# Altium project hearing_aid.PrjPcb
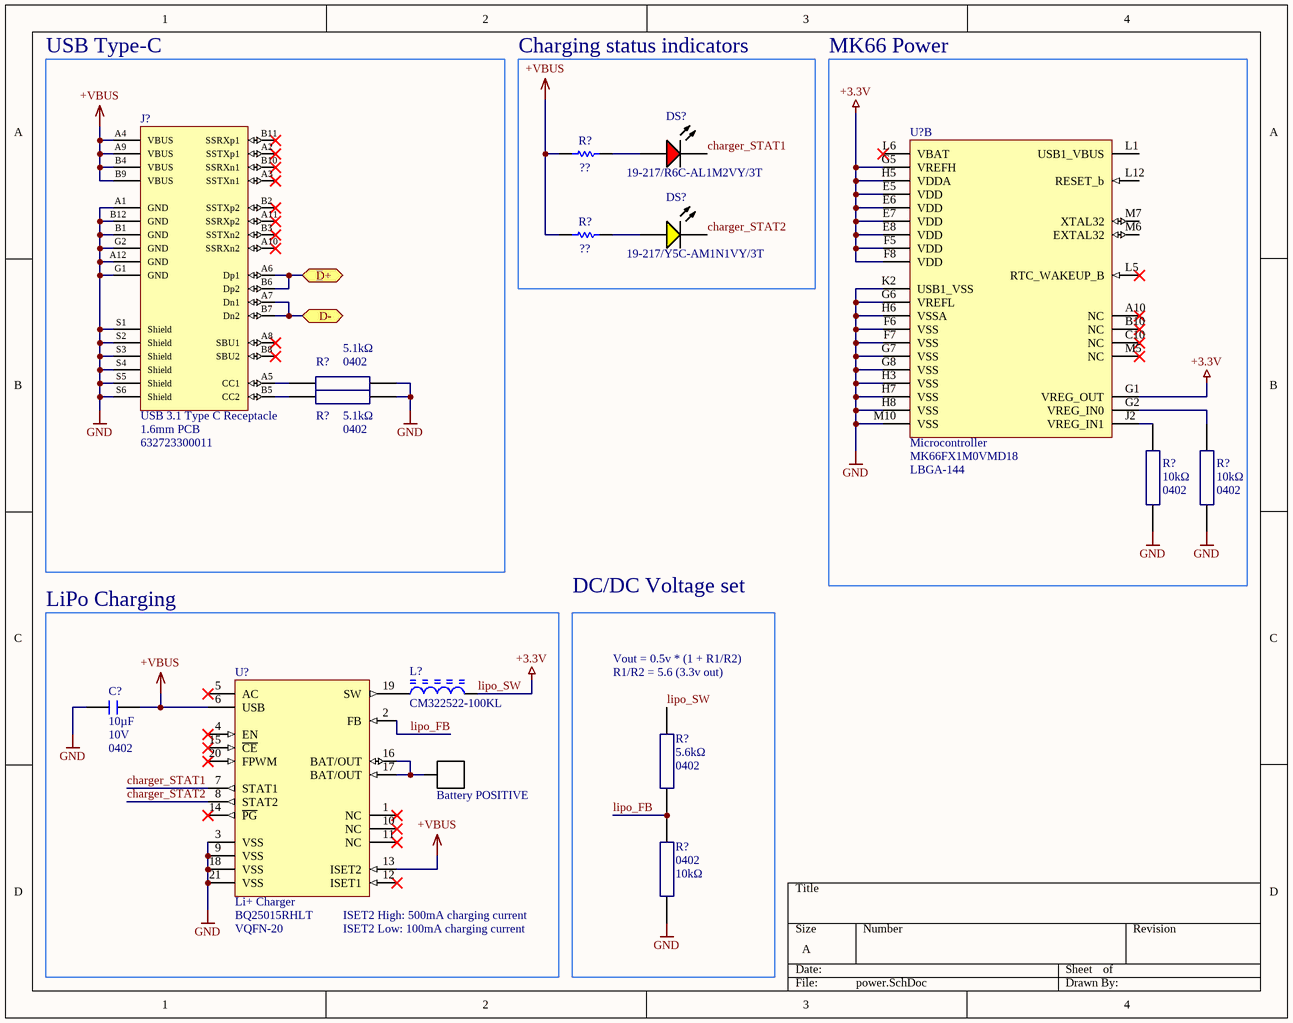
[diagram p0: power.SchDoc]
3 sheets, 45 parts. Net scope: flat (ports and power ports of the same name join across sheets).
Sheets:
  power.SchDoc
  digital.SchDoc
  audio.SchDoc

## Sheet power.SchDoc
size A

### Parts
(Parts that share a designator on the sheet are numbered #1, #2 ... from top to bottom, then left to right.)
Battery_POSITIVE  wire_pad_square  [WIRE_PAD_SQUARE]  (value not drawn)  (no BOM)
C?#1  Capacitance: 10µF  Voltage Rating: 10V  Case Code (Imperial): 0402  [0402_capacitor]  (hidden comment: CL05A106MP8NUB8)
DS?#1  19-217/R6C-AL1M2VY/3T  [EVRL-0603-2_V]
DS?#2  19-217/Y5C-AM1N1VY/3T  [EVRL-0603-2_V]
J?  USB 3.1 Type C Receptacle  PCB Thickness: 1.6mm PCB  [632723300011]
L?  CM322522-100KL  [BOUR-CM322522_V]
R?#1  value ??  [RESC1608X55X25ML10T15]  (hidden comment: Resistor 0R +/- 5% 0603 100 mW)
R?#2  value ??  [RESC1608X55X25ML10T15]  (hidden comment: Resistor 0R +/- 5% 0603 100 mW)
R?#3  Resistance: 5.1kΩ  Size Code: 0402  [0402_resistor]  (hidden comment: RMCF0402FT5K10)
R?#4  Resistance: 5.1kΩ  Size Code: 0402  [0402_resistor]  (hidden comment: RMCF0402FT5K10)
R?#5  Case Code (Imperial): 0402  Resistance: 10kΩ  [0402_resistor]  (hidden comment: RMCF0402FT10K0)
R?#6  Case Code (Imperial): 0402  Resistance: 10kΩ  [0402_resistor]  (hidden comment: RMCF0402FT10K0)
R?#7  Resistance: 5.6kΩ  Size Code: 0402  [0402_resistor]  (hidden comment: RMCF0402FT5K60_1)
R?#8  Case Code (Imperial): 0402  Resistance: 10kΩ  [0402_resistor]  (hidden comment: RMCF0402FT10K0)
U?#1  Microcontroller  Package: LBGA-144  [BGA-144]  (part B of 2)
U?#2  Li+ Charger  [VQFN-20]

### Blocks framed on the sheet
USB Type-C: J? R?#3 R?#4
Charging status indicators: DS?#1 DS?#2 R?#1 R?#2
MK66 Power: R?#5 R?#6 U?#1
LiPo Charging: Battery_POSITIVE C?#1 L? U?#2
DC/DC Voltage set: R?#7 R?#8

### Ports
D+ (bidir), D- (bidir)

### Nets
+VBUS: C?#1.2 J?.A4(VBUS) J?.A9(VBUS) J?.B4(VBUS) J?.B9(VBUS) R?#1.1 R?#2.1 U?#2.6(USB) U?#2.13(ISET2)
GND: C?#1.1 J?.A1(GND) J?.A12(GND) J?.B1(GND) J?.B12(GND) J?.G1(GND) J?.G2(GND) J?.S1(Shield) J?.S2(Shield) J?.S3(Shield) J?.S4(Shield) J?.S5(Shield) J?.S6(Shield) R?#3.2 R?#4.2 R?#5.1 R?#6.1 R?#8.1 U?#1.F6(VSS) U?#1.F7(VSS) U?#1.G6(VREFL) U?#1.G7(VSS) U?#1.G8(VSS) U?#1.H3(VSS) U?#1.H6(VSSA) U?#1.H7(VSS) U?#1.H8(VSS) U?#1.K2(USB1_VSS) U?#1.M10(VSS) U?#2.3(VSS) U?#2.9(VSS) U?#2.18(VSS) U?#2.21(VSS)
lipo_SW: L?.2 R?#7.2 U?#1.E5(VDD) U?#1.E6(VDD) U?#1.E7(VDD) U?#1.E8(VDD) U?#1.F5(VDD) U?#1.F8(VDD) U?#1.G1(VREG_OUT) U?#1.G5(VREFH) U?#1.H5(VDDA)  [also labelled +3.3V]
charger_STAT1: DS?#1.2(K) U?#2.7(STAT1)
charger_STAT2: DS?#2.2(K) U?#2.8(STAT2)
lipo_FB: R?#7.1 R?#8.2 U?#2.2(FB)
NetBattery_POSITIVE_1: Battery_POSITIVE.1 U?#2.16(BAT/OUT) U?#2.17(BAT/OUT)
NetDS?#1_1: DS?#1.1(A) R?#1.2
NetDS?#2_1: DS?#2.1(A) R?#2.2
NetJ?_A5: J?.A5(CC1) R?#3.1
NetJ?_A6: J?.A6(Dp1) J?.B6(Dp2) ; port D+
NetJ?_A7: J?.A7(Dn1) J?.B7(Dn2) ; port D-
NetJ?_B5: J?.B5(CC2) R?#4.1
NetL?_1: L?.1 U?#2.19(SW)
NetR?#5_2: R?#5.2 U?#1.J2(VREG_IN1)
NetR?#6_2: R?#6.2 U?#1.G2(VREG_IN0)

Not connected (* = marked no-connect by the designer): J? A2(SSTXp1)* A3(SSTXn1)* A8(SBU1)* A10(SSRXn2)* A11(SSRXp2)* B2(SSTXp2)* B3(SSTXn2)* B8(SBU2)* B10(SSRXn1)* B11(SSRXp1)*; U?#1 A10(NC)* B10(NC)* C10(NC)* L1(USB1_VBUS) L5(RTC_WAKEUP_B)* L6(VBAT)* L12(RESET_b) M5(NC)* M6(EXTAL32) M7(XTAL32); U?#2 1(NC)* 4(EN)* 5(AC)* 10(NC)* 11(NC)* 12(ISET1)* 14(~{PG})* 15(~{CE})* 20(FPWM)*

### Notes on the sheet
- Vout = 0.5v * (1 + R1/R2)
- R1/R2 = 5.6 (3.3v out)
- (near U?#2) ISET2 High: 500mA charging current
- (near U?#2) ISET2 Low: 100mA charging current

### Library data of the parts
Battery_POSITIVE = wire_pad_square: 1.5mm square wire pad
C?#1 = CL05A106MP8NUB8: 10 µF, 10 V, X5R, 0402 Chip capacitor; Manufacturer: Samsung; Tolerance: 20%; Supplier 1: Digi-Key; Supplier Part Number 1: 1276-6830-1-ND; RoHS: Yes; Category: Ceramic Capacitors; Stock 1: 740658; Pricing 1: 1=0.36000, 10=0.25300, 50=0.17720, 100=0.15180, 500=0.11384, 1000=0.09614, 2500=0.09108 (USD); Mount: Surface Mount; Case/Package: 0402; Case Code (Metric): 1005; Min Operating Temperature: -55°C; Max Operating Temperature: 85°C; Packaging: Tape and Reel; Length: 0.039inch; Width: 0.02inch; Thickness: 0.035inch; RoHS Compliant: Yes; ComponentLink1URL: http://www.samsungsem.com/kr/support/product-search/mlcc/CL05A106MP8NUB8.jsp?src-supplier=Digi-Key; ComponentLink1Description: http://www.samsungsem.com/kr/support/product-search/mlcc/CL05A106MP8NUB8.jsp?src-supplier=Digi-Key; Manufacturer Part Number: CL05A106MP8NUB8
DS?#1 = CMP-007-00004-2: Chip LED, Red, 5 V, 25 mA, -40 to 85 degC, 2-Pin SMD (0603), RoHS, Tape and Reel; Manufacturer: Everlight Electronics; Forward Voltage: 2.2V; Lens Style: Clear; Package Reference: 0603; Datasheet Version: Rev. 1, 01/2005; Mounting Technology: SM; RoHS Compliant: False; Datasheet URL: https://datasheet.ciiva.com/4688/el-19-217-r6c-al1m2vy-3tpdf-187026-4688713.pdf; Case/Package: 0603; Colour: Red; Manufacturer URL: http://www.everlight.com/; Package Description: 2-Pin Surface Mount Device, Body 1.6 x 0.8 mm
DS?#2 = CMP-007-00005-2: Chip LED, Yellow, 5 V, 25mA, -40 to 85 degC, 2-Pin SMD (0603), RoHS, Tape and Reel; Manufacturer: Everlight Electronics; Datasheet Version: Rev. 1.0, 12/2005; Package Reference: 0603; Mounting Technology: SM; Package Description: 2-Pin Surface Mount Device, Body 1.6 x 0.8 mm; Case/Package: 0603; Datasheet URL: http://www.fairchip.com/pdf/Everlight/19-217-Y5C-AM1N1VY-3T.pdf; Manufacturer URL: http://www.everlight.com/; RoHS Compliant: False
J? = 632723300011: USB-C jack; Manufacturer: Wurth Electronics; Number of Contacts: 24; Supplier 1: Digi-Key; Stock 1: 18753; Pricing 1: 1=4.1, 10=3.8, 50=3.2, 100=2.95 (USD); Mount: Surface Mount,Through Hole; Packaging: Tape and Reel; Connector Type: USB; Gender: Receptacle; ComponentLink1URL: https://www.mouser.com/ds/2/445/632723x00011-782157.pdf?src-supplier=Mouser; ComponentLink1Description: https://www.mouser.com/ds/2/445/632723x00011-782157.pdf?src-supplier=Mouser; ComponentLink2URL: https://katalog.we-online.de/em/datasheet/632723x00011.pdf?src-supplier=Digi-Key; ComponentLink2Description: https://katalog.we-online.de/em/datasheet/632723x00011.pdf?src-supplier=Digi-Key; Supplier Part Number 1: 732-9618-1-ND; Manufacturer Part Number: 632723300011
L? = CMP-1747-00008-1: Chip Inductor / , 10 uH, +/- 10%, -40 to 125 degC, 1210 (3225 Metric), RoHS, Tape and Reel; Current Rating: 1.5 A; Colour: White; Gender: Female; Connector Type: USB; Min Operating Temperature: -55 degC; ComponentLink2Description: Datasheet; Packaging: Tray; Contact Material: Bronze; ComponentLink1Description: Manufacturer URL; PackageDescription: 2-Pin Surface Mount Device, Body 3.2 x 2.5 mm; Contact Plating: Gold; Max Operating Temperature: 85 degC; ComponentLink2URL: http://www.bourns.com/docs/Product-Datasheets/cm322522.pdf; PackageReference: 1210; Radiation Hardening: No; DatasheetVersion: Aug-14; Package Quantity: 100; Pins: 4; Mount: Through Hole; Lead Pitch: 2.5 mm; ComponentLink1URL: http://www.bourns.com/; Height: 15.9 mm; RoHSCompliant: true; Width: 11.15 mm
R?#1 R?#2 = CMP-009-00006-5: 5.1k; Power: 100mW; Voltage Rating: 50V; Max Operating Temperature: 155°C; RoHS Compliant: True; Mounting Technology: SM; Case/Package: 0603; Min Operating Temperature: -55°C; Tolerance: 5%; Pins: 2
R?#3 R?#4 = RMCF0402FT5K10: 5.1k Ω, 0402 Chip resistor; Manufacturer: Stackpole Electronics; Manufacturer Part Number: RMCF0402FT27R0; Tolerance: 1%; Rated Power Dissipation (P): 63mW; Rated Temperature: 70°C; Temperature Coefficient: 100ppm/°C; Working Voltage: 50V; Package Height: 0.3mm; Package Length: 1mm; Package Width: 0.5mm; Reference Standard: AEC-Q200; RoHS: Yes; Category: Chip SMD Resistors; Stock 1: 3710; Pricing 1: 1=0.10000, 10=0.01500, 100=0.00610, 1000=0.00274, 2500=0.00238, 5000=0.00197 (USD); Mount: Surface Mount; Number of Pins: 2; Package Shape: Rectangular; Terminal Finish: Nickel; Min Operating Temperature: -55°C; Max Operating Temperature: 155°C; JESD-609 Code: e3; Resistor Type: FIXED RESISTOR; Construction: Rectangular; Package Style: SMTMeter; Packaging: Tape and Reel; Technology: METAL GLAZE/THICK FILM; Termination: Wraparound; REACH SVHC: Yes; RoHS Compliant: Yes
R?#5 R?#6 R?#8 = RMCF0402FT10K0: 10 kΩ, 0402 Chip resistor; Manufacturer: Stackpole Electronics; Tolerance: 1%; Power Rating: 62.5mW; Temperature Coefficient: 100ppm/°C; Max Power Dissipation: 63mW; Supplier 1: Digi-Key; Manufacturer Part Number: RMCF0402FT10K0; RoHS: Yes; Category: Chip SMD Resistors; Stock 1: 7219214; Pricing 1: 1=0.10000, 10=0.01300, 100=0.00530, 1000=0.00239, 2500=0.00207, 5000=0.00171 (USD); Mount: Surface Mount; Case/Package: 0402; Case Code (Metric): 1005; Contact Plating: Tin,Matte; Size Code: 0402; Min Operating Temperature: -55°C; Max Operating Temperature: 155°C; Packaging: Tape and Reel; Resistor Type: Thick Film; Number of Terminations: 2; Features: Automotive AEC-Q200; Series: RMCF; Construction: Rectangular; Length: 1mm; Width: 0.02inch; Height: 0.016inch; Depth: 0.5mm; Radiation Hardening: No; Military Standard: Not; Lead Free: Lead Free; RoHS Compliant: Yes; ComponentLink1URL: https://datasheet.ciiva.com/24341/sei-rmcp-24341800.pdf?src-supplier=Onlinecomponents.com; ComponentLink1Description: https://datasheet.ciiva.com/24341/sei-rmcp-24341800.pdf?src-supplier=Onlinecomponents.com; Supplier Part Number 1: RMCF0402FT10K0CT-ND
R?#7 = RMCF0402FT5K60_1: 5.6k Ω, 0402 Chip resistor; Manufacturer: Stackpole Electronics; Manufacturer Part Number: RMCF0402FT27R0; Tolerance: 1%; Rated Power Dissipation (P): 63mW; Rated Temperature: 70°C; Temperature Coefficient: 100ppm/°C; Working Voltage: 50V; Package Height: 0.3mm; Package Length: 1mm; Package Width: 0.5mm; Reference Standard: AEC-Q200; RoHS: Yes; Category: Chip SMD Resistors; Stock 1: 3710; Pricing 1: 1=0.10000, 10=0.01500, 100=0.00610, 1000=0.00274, 2500=0.00238, 5000=0.00197 (USD); Mount: Surface Mount; Number of Pins: 2; Package Shape: Rectangular; Terminal Finish: Nickel; Min Operating Temperature: -55°C; Max Operating Temperature: 155°C; JESD-609 Code: e3; Resistor Type: FIXED RESISTOR; Construction: Rectangular; Package Style: SMTMeter; Packaging: Tape and Reel; Technology: METAL GLAZE/THICK FILM; Termination: Wraparound; REACH SVHC: Yes; RoHS Compliant: Yes
U?#1 = MK66FX1M0VMD18: ARM Cortex-M4 microcontroller; Manufacturer: NXP Freescale; Supplier 1: Digi-Key; Stock 1: 0; Pricing 1: 1=23.34, 10=23.108 (USD); RoHS Compliant: Yes; ComponentLink1URL: http://www.mouser.com/ds/2/302/K66P144M180SF5V2-907544.pdf?src-supplier=Mouser; ComponentLink1Description: http://www.mouser.com/ds/2/302/K66P144M180SF5V2-907544.pdf?src-supplier=Mouser; ComponentLink2URL: https://www.nxp.com/docs/en/package-information/98ASA00222D.pdf?src-supplier=Digi-Key; ComponentLink2Description: https://www.nxp.com/docs/en/package-information/98ASA00222D.pdf?src-supplier=Digi-Key; ComponentLink3URL: http://www.farnell.com/datasheets/2292635.pdf?src-supplier=Farnell; ComponentLink3Description: http://www.farnell.com/datasheets/2292635.pdf?src-supplier=Farnell; ComponentLink4URL: http://www.farnell.com/datasheets/2292635.pdf?src-supplier=Newark; ComponentLink4Description: http://www.farnell.com/datasheets/2292635.pdf?src-supplier=Newark; Supplier Part Number 1: 568-13335-ND; Manufacturer Part Number: MK66FX1M0VMD18
U?#2 = BQ25015RHLT: Li+ Battery Chager, VQFN-20; Manufacturer: Texas Instruments; Output Voltage: 700mV; Output Current: 500mA; Number of Cells: 1; Max Supply Voltage: 6.5V; Min Supply Voltage: 4.35V; Min Input Voltage: 4.5V; Switching Frequency: 1MHz; Supplier 1: Digi-Key; Stock 1: 62; Pricing 1: 1=4.78, 10=4.289, 25=4.0544, 100=3.5139 (USD); Case/Package: VQFN; Number of Pins: 20; Weight: 0.001668oz; Contact Plating: Gold; Min Operating Temperature: -40°C; Max Operating Temperature: 125°C; Package Quantity: 1; Series: -; Packaging: Tape and Reel; Max Output Current: 500mA; Max Charge Current: 500mA; Length: 4.5mm; Width: 3.5mm; Height: 0.9mm; Radiation Hardening: No; REACH SVHC: No SVHC; Lead Free: Lead Free; RoHS Compliant: Yes; ComponentLink1URL: http://www.ti.com/lit/ds/symlink/bq25017.pdf?src-supplier=Farnell; ComponentLink1Description: http://www.ti.com/lit/ds/symlink/bq25017.pdf?src-supplier=Farnell; ComponentLink2URL: http://www.ti.com/lit/ds/symlink/bq25017.pdf?src-supplier=Element14; ComponentLink2Description: http://www.ti.com/lit/ds/symlink/bq25017.pdf?src-supplier=Element14; ComponentLink3URL: http://www.ti.com/general/docs/suppproductinfo.tsp?distId=10&amp;gotoUrl=http%3A%2F%2Fwww.ti.com%2Flit%2Fgpn%2Fbq25015&src-supplier=Digi-Key; ComponentLink3Description: http://www.ti.com/general/docs/suppproductinfo.tsp?distId=10&amp;gotoUrl=http%3A%2F%2Fwww.ti.com%2Flit%2Fgpn%2Fbq25015&src-supplier=Digi-Key; ComponentLink4URL: https://media.digikey.com/pdf/Data%20Sheets/Texas%20Instruments%20PDFs/BQ25015,17.pdf?src-supplier=Digi-Key; ComponentLink4Description: https://media.digikey.com/pdf/Data%20Sheets/Texas%20Instruments%20PDFs/BQ25015,17.pdf?src-supplier=Digi-Key; ComponentLink5URL: http://www.ti.com/lit/gpn/bq25015?src-supplier=Mouser; ComponentLink5Description: http://www.ti.com/lit/gpn/bq25015?src-supplier=Mouser; ComponentLink6URL: http://www.ti.com/general/docs/lit/getliterature.tsp?genericPartNumber=BQ25017&&fileType=pdf&src-supplier=Avnet; ComponentLink6Description: http://www.ti.com/general/docs/lit/getliterature.tsp?genericPartNumber=BQ25017&&fileType=pdf&src-supplier=Avnet; Supplier Part Number 1: 296-32034-1-ND; Manufacturer Part Number: BQ25015RHLT; Package: VQFN-20

## Sheet digital.SchDoc
size B
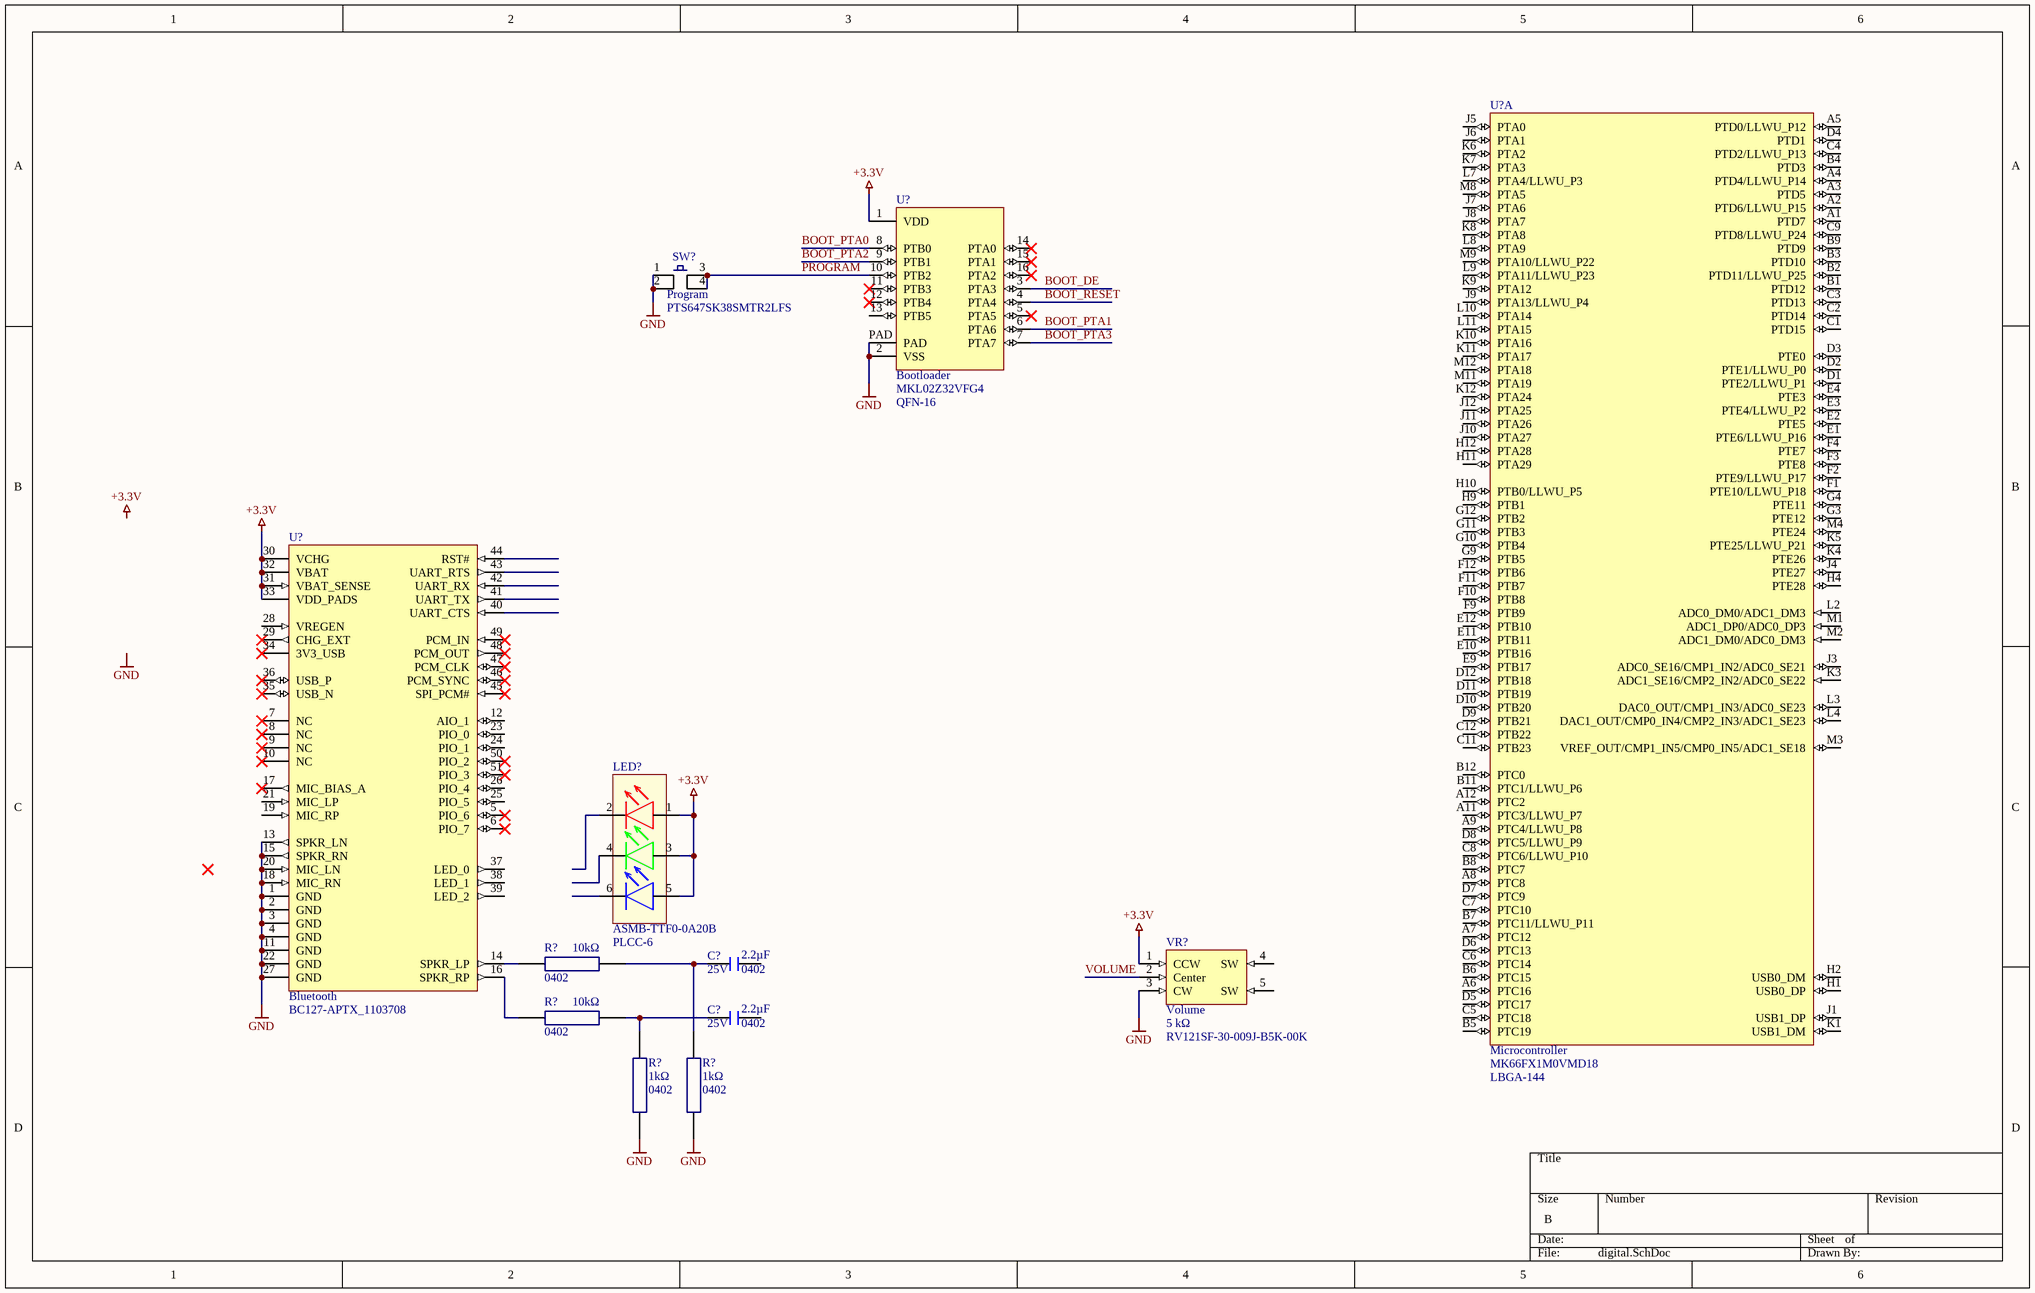
[diagram p1: digital.SchDoc]

### Parts
(Parts that share a designator on the sheet are numbered #1, #2 ... from top to bottom, then left to right.)
C?#2  Size Code: 0402  Capacitance: 2.2µF  Rated DC Voltage (URdc): 25V  [0402_capacitor]  (hidden comment: TMK105CBJ225MV-F)
C?#3  Size Code: 0402  Capacitance: 2.2µF  Rated DC Voltage (URdc): 25V  [0402_capacitor]  (hidden comment: TMK105CBJ225MV-F)
LED?  ASMB-TTF0-0A20B  [PLCC-6]
R?#9  Case Code (Imperial): 0402  Resistance: 10kΩ  [0402_resistor]  (hidden comment: RMCF0402FT10K0)
R?#10  Case Code (Imperial): 0402  Resistance: 10kΩ  [0402_resistor]  (hidden comment: RMCF0402FT10K0)
R?#11  Resistance: 1kΩ  Size Code: 0402  [0402_resistor]  (hidden comment: RMCF0402FT1K00)
R?#12  Resistance: 1kΩ  Size Code: 0402  [0402_resistor]  (hidden comment: RMCF0402FT1K00)
SW?  Program  [PTS647SK38SMTR2LFS]
U?#3  Bootloader  [QFN-16]
U?#4  Microcontroller  Package: LBGA-144  [BGA-144]  (part A of 2)
U?#5  Bluetooth  [BC127]
VR?  Volume  Resistance: 5 kΩ  [RV121SF-30-009J-B5K-00K]

### Nets
+3.3V: LED?.1 LED?.3 LED?.5 U?#3.1(VDD) U?#5.30(VCHG) U?#5.31(VBAT_SENSE) U?#5.32(VBAT) U?#5.33(VDD_PADS) VR?.1(CCW)  [project net lipo_SW]
GND: R?#11.1 R?#12.1 SW?.1 SW?.2 U?#3.2(VSS) U?#3.PAD U?#5.1(GND) U?#5.2(GND) U?#5.3(GND) U?#5.4(GND) U?#5.11(GND) U?#5.13(SPKR_LN) U?#5.15(SPKR_RN) U?#5.18(MIC_RN) U?#5.20(MIC_LN) U?#5.22(GND) U?#5.27(GND) VR?.3(CW)
BOOT_DE: U?#3.3(PTA3)
BOOT_PTA0: U?#3.8(PTB0)
BOOT_PTA1: U?#3.6(PTA6)
BOOT_PTA2: U?#3.9(PTB1)
BOOT_PTA3: U?#3.7(PTA7)
BOOT_RESET: U?#3.4(PTA4)
PROGRAM: SW?.3 SW?.4 U?#3.10(PTB2)
VOLUME: VR?.2(Center)
NetC?#2_1: C?#2.1 R?#9.2 R?#12.2
NetC?#3_1: C?#3.1 R?#10.2 R?#11.2
NetR?#9_1: R?#9.1 U?#5.14(SPKR_LP)
NetR?#10_1: R?#10.1 U?#5.16(SPKR_RP)

Not connected (* = marked no-connect by the designer): C?#2 2; C?#3 2; LED? 2 4 6; U?#3 5(PTA5)* 11(PTB3)* 12(PTB4)* 13(PTB5) 14(PTA0)* 15(PTA1)* 16(PTA2)*; U?#4 A1(PTD7) A2(PTD6/LLWU_P15) A3(PTD5) A4(PTD4/LLWU_P14) A5(PTD0/LLWU_P12) A6(PTC16) A7(PTC12) A8(PTC8) A9(PTC4/LLWU_P8) A11(PTC3/LLWU_P7) A12(PTC2) B1(PTD12) B2(PTD11/LLWU_P25) B3(PTD10) B4(PTD3) B5(PTC19) B6(PTC15) B7(PTC11/LLWU_P11) B8(PTC7) B9(PTD9) B11(PTC1/LLWU_P6) B12(PTC0) C1(PTD15) C2(PTD14) C3(PTD13) C4(PTD2/LLWU_P13) C5(PTC18) C6(PTC14) C7(PTC10) C8(PTC6/LLWU_P10) C9(PTD8/LLWU_P24) C11(PTB23) C12(PTB22) D1(PTE2/LLWU_P1) D2(PTE1/LLWU_P0) D3(PTE0) D4(PTD1) D5(PTC17) D6(PTC13) D7(PTC9) D8(PTC5/LLWU_P9) D9(PTB21) D10(PTB20) D11(PTB19) D12(PTB18) E1(PTE6/LLWU_P16) E2(PTE5) E3(PTE4/LLWU_P2) E4(PTE3) E9(PTB17) E10(PTB16) E11(PTB11) E12(PTB10) F1(PTE10/LLWU_P18) F2(PTE9/LLWU_P17) F3(PTE8) F4(PTE7) F9(PTB9) F10(PTB8) F11(PTB7) F12(PTB6) G3(PTE12) G4(PTE11) G9(PTB5) G10(PTB4) G11(PTB3) G12(PTB2) H1(USB0_DP) H2(USB0_DM) H4(PTE28) H9(PTB1) H10(PTB0/LLWU_P5) H11(PTA29) H12(PTA28) J1(USB1_DP) J3(ADC0_SE16/CMP1_IN2/ADC0_SE21) J4(PTE27) J5(PTA0) J6(PTA1) J7(PTA6) J8(PTA7) J9(PTA13/LLWU_P4) J10(PTA27) J11(PTA26) J12(PTA25) K1(USB1_DM) K3(ADC1_SE16/CMP2_IN2/ADC0_SE22) K4(PTE26) K5(PTE25/LLWU_P21) K6(PTA2) K7(PTA3) K8(PTA8) K9(PTA12) K10(PTA16) K11(PTA17) K12(PTA24) L2(ADC0_DM0/ADC1_DM3) L3(DAC0_OUT/CMP1_IN3/ADC0_SE23) L4(DAC1_OUT/CMP0_IN4/CMP2_IN3/ADC1_SE23) L7(PTA4/LLWU_P3) L8(PTA9) L9(PTA11/LLWU_P23) L10(PTA14) L11(PTA15) M1(ADC1_DP0/ADC0_DP3) M2(ADC1_DM0/ADC0_DM3) M3(VREF_OUT/CMP1_IN5/CMP0_IN5/ADC1_SE18) M4(PTE24) M8(PTA5) M9(PTA10/LLWU_P22) M11(PTA19) M12(PTA18); U?#5 5(PIO_6)* 6(PIO_7)* 7(NC)* 8(NC)* 9(NC)* 10(NC)* 12(AIO_1) 17(MIC_BIAS_A)* 19(MIC_RP) 21(MIC_LP) 23(PIO_0) 24(PIO_1) 25(PIO_5) 26(PIO_4) 28(VREGEN) 29(CHG_EXT)* 34(3V3_USB)* 35(USB_N)* 36(USB_P)* 37(LED_0) 38(LED_1) 39(LED_2) 40(UART_CTS) 41(UART_TX) 42(UART_RX) 43(UART_RTS) 44(RST#) 45(SPI_PCM#)* 46(PCM_SYNC)* 47(PCM_CLK)* 48(PCM_OUT)* 49(PCM_IN)* 50(PIO_2)* 51(PIO_3)*; VR? 4(SW) 5(SW)

### Notes on the sheet
- Labels drawn without touching a wire or pin: +3.3V, GND

### Library data of the parts
C?#2 C?#3 = TMK105CBJ225MV-F: 2.2 µF, 25 V, X5R, 0402 Chip Capacitor; Manufacturer: Taiyo Yuden; Dielectric Material: Ceramic; Multilayer: Yes; Negative Tolerance: 20%; Supplier 1: Digi-Key; Supplier Part Number 1: 587-6022-1-ND; RoHS: Yes; Category: Ceramic Capacitors; Stock 1: 6102; Pricing 1: 1=0.22000, 10=0.15600, 50=0.08880, 100=0.07350, 500=0.05156, 1000=0.04269, 2500=0.03973, 5000=0.03635 (USD); Mount: Surface Mount; Number of Pins: 2; Package Shape: Rectangular; Min Operating Temperature: -55°C; Max Operating Temperature: 85°C; Capacitor Type: Ceramic; Package Style: SMTMeter; Packaging: Tape and Reel; Positive Tolerance: 20%; Temperature Characteristics Code: X5R; Termination: Wraparound; Length: 1mm; Width: 0.5mm; Height: 0.5mm; REACH SVHC: Yes; RoHS Compliant: Yes; ComponentLink1URL: https://datasheet.ciiva.com:443/pdfs/VipMasterIC/IC/TAIY/TAIY-S-A0009103435/TAIY-S-A0009102688-1.pdf?src-supplier=IHS+Markit; ComponentLink1Description: https://datasheet.ciiva.com:443/pdfs/VipMasterIC/IC/TAIY/TAIY-S-A0009103435/TAIY-S-A0009102688-1.pdf?src-supplier=IHS+Markit; ComponentLink2URL: https://ds.yuden.co.jp/TYCOMPAS/ut/detail?pn=TMK105CBJ225MV-F &amp;u=M&src-supplier=Digi-Key; ComponentLink2Description: https://ds.yuden.co.jp/TYCOMPAS/ut/detail?pn=TMK105CBJ225MV-F &amp;u=M&src-supplier=Digi-Key; ComponentLink3URL: http://ds.yuden.co.jp/TYCOMPAS/ut/detail.do?productNo=TMK105CBJ225MV-F&amp;fileName=TMK105CBJ225MV-F_SS&amp;mode=specSheetDownload&src-supplier=Digi-Key; ComponentLink3Description: http://ds.yuden.co.jp/TYCOMPAS/ut/detail.do?productNo=TMK105CBJ225MV-F&amp;fileName=TMK105CBJ225MV-F_SS&amp;mode=specSheetDownload&src-supplier=Digi-Key; Manufacturer Part Number: TMK105CBJ225MV-F
LED? = ASMB-TTF0-0A20B: RGB LED; Manufacturer: Broadcom Avago; Color: Blue,Green,Red; Lens Style: Round,Flat; Lens Transparency: Diffused; Luminous Intensity: 410mcd; Forward Voltage: 2.9V; Test Current: 20mA; Viewing Angle: 110°; Dominant Wavelength: 471nm; Supplier 1: Digi-Key; RoHS: Yes; Category: LEDs; Stock 1: 27651; Pricing 1: 1=0.55000, 10=0.33900, 100=0.19500, 1000=0.15264 (USD); Mount: Surface Mount; Number of Pins: 6; Packaging: Cut Tape; Length: 3.7mm; Width: 3.5mm; Height: 3mm; RoHS Compliant: Yes; ComponentLink1URL: https://media.digikey.com/pdf/Data%20Sheets/Avago%20PDFs/ASMB-TTF0-0A20B.pdf?src-supplier=Digi-Key; ComponentLink1Description: https://media.digikey.com/pdf/Data%20Sheets/Avago%20PDFs/ASMB-TTF0-0A20B.pdf?src-supplier=Digi-Key; ComponentLink2URL: http://www.farnell.com/datasheets/2608170.pdf?src-supplier=Farnell; ComponentLink2Description: http://www.farnell.com/datasheets/2608170.pdf?src-supplier=Farnell; ComponentLink3URL: http://www.farnell.com/datasheets/2608170.pdf?src-supplier=Newark; ComponentLink3Description: http://www.farnell.com/datasheets/2608170.pdf?src-supplier=Newark; Supplier Part Number 1: 516-3908-1-ND; Supplier 2: Digi-Key; Supplier Part Number 2: 516-3909-1-ND; Manufacturer Part Number: ASMB-TTF0-0A20B; Case/Package: PLCC-6
R?#9 R?#10 = RMCF0402FT10K0: as R?#5 on sheet power; Supplier 1: Digi-Key; Manufacturer Part Number: RMCF0402FT10K0; RoHS: Yes; Category: Chip SMD Resistors; Stock 1: 7219214; Pricing 1: 1=0.10000, 10=0.01300, 100=0.00530, 1000=0.00239, 2500=0.00207, 5000=0.00171 (USD); Mount: Surface Mount; Case/Package: 0402; Case Code (Metric): 1005; Contact Plating: Tin,Matte; Size Code: 0402; Min Operating Temperature: -55°C; Max Operating Temperature: 155°C; Packaging: Tape and Reel; Resistor Type: Thick Film; Number of Terminations: 2; Features: Automotive AEC-Q200; Series: RMCF; Construction: Rectangular; Length: 1mm; Width: 0.02inch; Height: 0.016inch; Depth: 0.5mm; Radiation Hardening: No; Military Standard: Not; Lead Free: Lead Free; RoHS Compliant: Yes; ComponentLink1URL: https://datasheet.ciiva.com/24341/sei-rmcp-24341800.pdf?src-supplier=Onlinecomponents.com; ComponentLink1Description: https://datasheet.ciiva.com/24341/sei-rmcp-24341800.pdf?src-supplier=Onlinecomponents.com; Supplier Part Number 1: RMCF0402FT10K0CT-ND
R?#11 R?#12 = RMCF0402FT1K00: 1 kΩ, 0402 Chip resistor; Manufacturer: Stackpole Electronics; Tolerance: 1%; Power Rating: 63mW; Temperature Coefficient: 100ppm/°C; Manufacturer Part Number: RMCF0402FT1K00; RoHS: Yes; Category: Chip SMD Resistors; Stock 1: 304945; Pricing 1: 1=0.00420, 500=0.00300, 1500=0.00290, 2500=0.00280, 5000=0.00270 (USD); Mount: Surface Mount; Case/Package: 0402; Case Code (Metric): 1005; Case Code (Imperial): 0402; Contact Plating: Tin,Matte; Min Operating Temperature: -55°C; Max Operating Temperature: 155°C; Packaging: Tape and Reel; Resistor Type: Thick Film; Number of Terminations: 2; Max Power Dissipation: 63mW; Features: Automotive AEC-Q200; Series: RMCF; Construction: Rectangular; Length: 1mm; Width: 0.02inch; Height: 0.016inch; Depth: 0.5mm; Radiation Hardening: No; Military Standard: Not; Lead Free: Lead Free; RoHS Compliant: Yes; ComponentLink1URL: https://datasheet.ciiva.com/15193/getdatasheetpartid-365385-15193418.pdf?src-supplier=Verical; ComponentLink1Description: https://datasheet.ciiva.com/15193/getdatasheetpartid-365385-15193418.pdf?src-supplier=Verical; ComponentLink2URL: https://datasheet.ciiva.com/24336/sei-rmcp-24336266.pdf?src-supplier=Onlinecomponents.com; ComponentLink2Description: https://datasheet.ciiva.com/24336/sei-rmcp-24336266.pdf?src-supplier=Onlinecomponents.com; Supplier 1: Digi-Key; Supplier Part Number 1: RMCF0402FT1K00CT-ND
SW? = PTS647SK38SMTR2LFS: Tactile switch, SPST; Manufacturer: ITT C&K; Mechanical Life: 100000Cycles; Illumination Type: Non-Illuminated; Switch Function: Off-Mom; Actuator Type: Standard; Operating Force: 250gf; Switch Travel: 0.25mm; Ratings: IP40; Supplier 1: Digi-Key; RoHS: No; Category: Tactile Switches; Stock 1: 68566; Pricing 1: 1=0.13000, 10=0.12700, 25=0.12080, 100=0.10970, 250=0.10308, 500=0.09432, 1000=0.07897 (USD); Mount: Surface Mount; Min Operating Temperature: -20°C; Max Operating Temperature: 70°C; Throw Configuration: SPST; Packaging: Tape and Reel; Termination: Gull Wing; ComponentLink1URL: https://www.ckswitches.com/media/2567/pts647.pdf?src-supplier=Digi-Key; ComponentLink1Description: https://www.ckswitches.com/media/2567/pts647.pdf?src-supplier=Digi-Key; Supplier Part Number 1: PTS647SK38SMTR2LFSCT-ND; Manufacturer Part Number: PTS647SK38SMTR2LFS
U?#3 = MKL02Z32VFG4: ARM Cortex-M0+; Manufacturer: NXP Freescale; Max Supply Voltage: 3.6V; RAM Size: 4KB; Number of USB Channels: 1; Number of PWM Channels: 2; Interface: I2C,SPI,UART,USART; Min Supply Voltage: 1.71V; Frequency: 48MHz; Number of I/Os: 14; Oscillator Type: Internal; Data Bus Width: 32b; Memory Type: FLASH; Memory Size: 32KB; Peripherals: Brown-out Detect/Reset,POR,PWM,WDT,LVD; Supplier 1: Digi-Key; Stock 1: 0; Pricing 1: 1=3.31, 10=2.584, 80=2.332 (USD); Mount: Surface Mount; Case/Package: QFN; Number of Pins: 16; Weight: 0.000564oz; Min Operating Temperature: -40°C; Max Operating Temperature: 105°C; Packaging: Tray; Number of Timers/Counters: 2; Package Quantity: 490; Number of ADC Channels: 1; Number of UART Channels: 1; Max Frequency: 48MHz; Number of SPI Channels: 1; Number of I2C Channels: 2; Core Architecture: ARM; Length: 3mm; Width: 3mm; Height: 0.75mm; REACH SVHC: No SVHC; RoHS Compliant: Yes; ComponentLink1URL: http://www.farnell.com/datasheets/1898381.pdf?src-supplier=Element14; ComponentLink1Description: http://www.farnell.com/datasheets/1898381.pdf?src-supplier=Element14; ComponentLink2URL: http://uk.rs-online.com/webdocs/12ba/0900766b812babaa.pdf?src-supplier=RSComponents; ComponentLink2Description: http://uk.rs-online.com/webdocs/12ba/0900766b812babaa.pdf?src-supplier=RSComponents; ComponentLink3URL: http://cache.freescale.com/files/32bit/doc/data_sheet/KL02P32M48SF0.pdf?src-supplier=Digi-Key; ComponentLink3Description: http://cache.freescale.com/files/32bit/doc/data_sheet/KL02P32M48SF0.pdf?src-supplier=Digi-Key; Supplier Part Number 1: MKL02Z32VFG4-ND; Manufacturer Part Number: MKL02Z32VFG4; Package: QFN-16
U?#4 = MK66FX1M0VMD18: as U?#1 on sheet power; Supplier 1: Digi-Key; Stock 1: 0; Pricing 1: 1=23.34, 10=23.108 (USD); RoHS Compliant: Yes; ComponentLink1URL: http://www.mouser.com/ds/2/302/K66P144M180SF5V2-907544.pdf?src-supplier=Mouser; ComponentLink1Description: http://www.mouser.com/ds/2/302/K66P144M180SF5V2-907544.pdf?src-supplier=Mouser; ComponentLink2URL: https://www.nxp.com/docs/en/package-information/98ASA00222D.pdf?src-supplier=Digi-Key; ComponentLink2Description: https://www.nxp.com/docs/en/package-information/98ASA00222D.pdf?src-supplier=Digi-Key; ComponentLink3URL: http://www.farnell.com/datasheets/2292635.pdf?src-supplier=Farnell; ComponentLink3Description: http://www.farnell.com/datasheets/2292635.pdf?src-supplier=Farnell; ComponentLink4URL: http://www.farnell.com/datasheets/2292635.pdf?src-supplier=Newark; ComponentLink4Description: http://www.farnell.com/datasheets/2292635.pdf?src-supplier=Newark; Supplier Part Number 1: 568-13335-ND; Manufacturer Part Number: MK66FX1M0VMD18
U?#5 = BC127-APTX_1103708: Bluetooth 4.2 Module with Integrated Antenna; Manufacturer: Sierra Wireless; Supplier 1: Digi-Key; Stock 1: 1671; Pricing 1: 1=35.82, 10=33.066, 25=30.3104, 100=28.0142, 250=26.6365, 500=25.05 (USD); Supplier Part Number 1: 1645-1042-1-ND; Manufacturer Part Number: BC127-APTX_1103708
VR? = RV121SF-30-009J-B5K-00K: 5 kΩ Linear potentiomer with switch; Manufacturer Part Number: RV121SF-30-009J-B5K-00K

## Sheet audio.SchDoc
size A
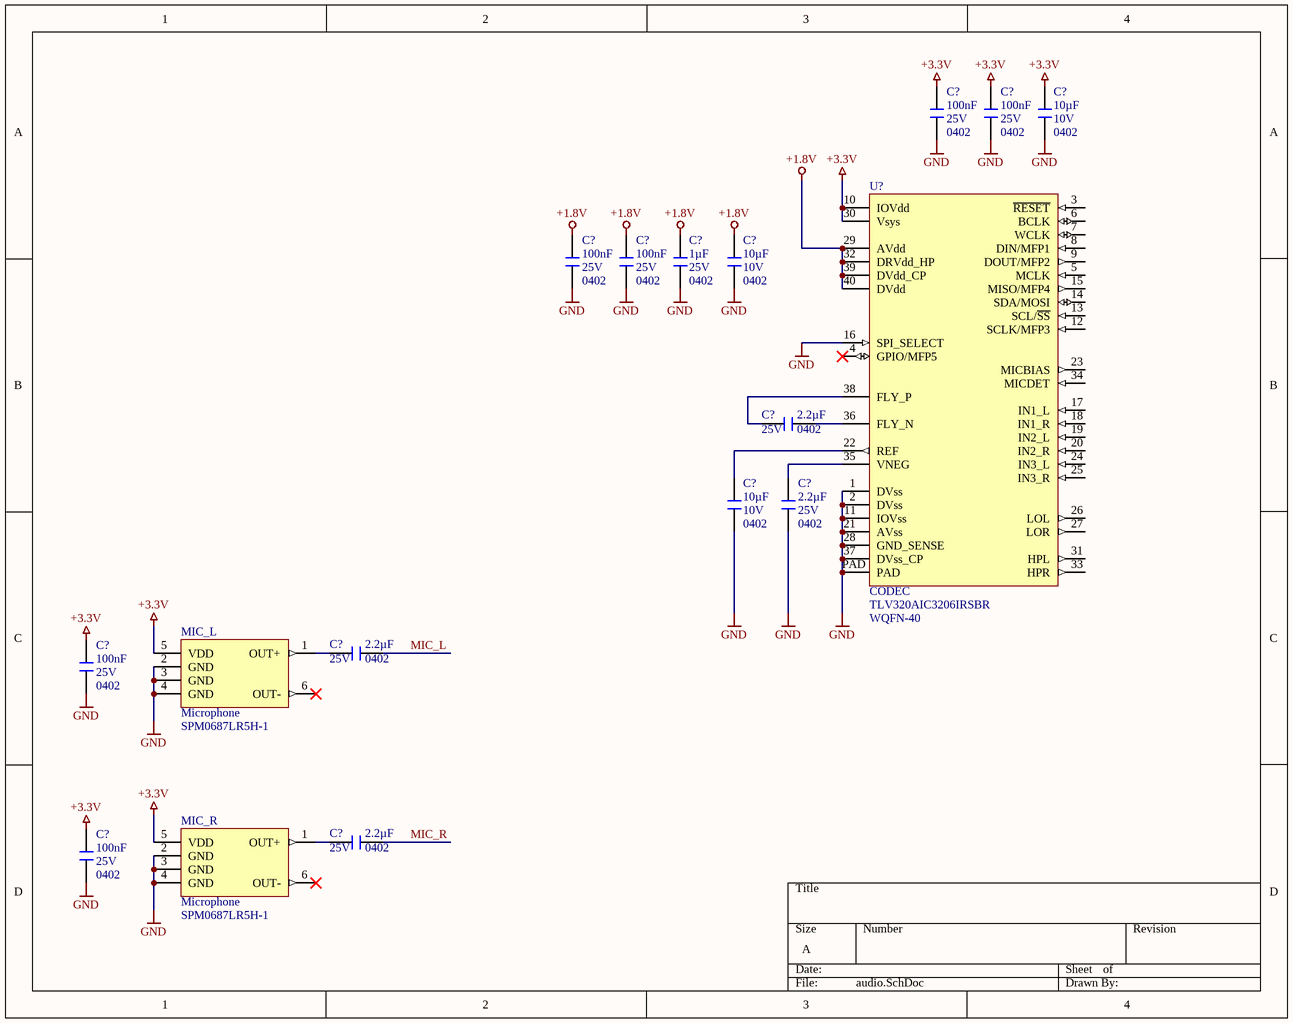
[diagram p2: audio.SchDoc]

### Parts
(Parts that share a designator on the sheet are numbered #1, #2 ... from top to bottom, then left to right.)
C?#4  Case Code (Imperial): 0402  Voltage: 25V  Capacitance: 100nF  [0402_capacitor]  (hidden comment: GRM155R71E104KE14D)
C?#5  Case Code (Imperial): 0402  Voltage: 25V  Capacitance: 100nF  [0402_capacitor]  (hidden comment: GRM155R71E104KE14D)
C?#6  Capacitance: 10µF  Voltage Rating: 10V  Case Code (Imperial): 0402  [0402_capacitor]  (hidden comment: CL05A106MP8NUB8)
C?#7  Case Code (Imperial): 0402  Voltage: 25V  Capacitance: 100nF  [0402_capacitor]  (hidden comment: GRM155R71E104KE14D)
C?#8  Case Code (Imperial): 0402  Voltage: 25V  Capacitance: 100nF  [0402_capacitor]  (hidden comment: GRM155R71E104KE14D)
C?#9  Size Code: 0402  Capacitance: 1µF  Voltage: 25V  [0402_capacitor]  (hidden comment: GRM155R61E105KA12D)
C?#10  Capacitance: 10µF  Voltage Rating: 10V  Case Code (Imperial): 0402  [0402_capacitor]  (hidden comment: CL05A106MP8NUB8)
C?#11  Size Code: 0402  Capacitance: 2.2µF  Rated DC Voltage (URdc): 25V  [0402_capacitor]  (hidden comment: TMK105CBJ225MV-F)
C?#12  Capacitance: 10µF  Voltage Rating: 10V  Case Code (Imperial): 0402  [0402_capacitor]  (hidden comment: CL05A106MP8NUB8)
C?#13  Size Code: 0402  Capacitance: 2.2µF  Rated DC Voltage (URdc): 25V  [0402_capacitor]  (hidden comment: TMK105CBJ225MV-F)
C?#14  Size Code: 0402  Capacitance: 2.2µF  Rated DC Voltage (URdc): 25V  [0402_capacitor]  (hidden comment: TMK105CBJ225MV-F)
C?#15  Case Code (Imperial): 0402  Voltage: 25V  Capacitance: 100nF  [0402_capacitor]  (hidden comment: GRM155R71E104KE14D)
C?#16  Size Code: 0402  Capacitance: 2.2µF  Rated DC Voltage (URdc): 25V  [0402_capacitor]  (hidden comment: TMK105CBJ225MV-F)
C?#17  Case Code (Imperial): 0402  Voltage: 25V  Capacitance: 100nF  [0402_capacitor]  (hidden comment: GRM155R71E104KE14D)
MIC_L  Microphone  [SPM0687LR5H-1]
MIC_R  Microphone  [SPM0687LR5H-1]
U?#6  CODEC  Package: WQFN-40  [QFN-40]

### Nets
+1.8V: C?#7.2 C?#8.2 C?#9.2 C?#10.2 U?#6.29(AVdd) U?#6.32(DRVdd_HP) U?#6.39(DVdd_CP) U?#6.40(DVdd)
+3.3V: C?#4.2 C?#5.2 C?#6.2 C?#15.2 C?#17.2 MIC_L.5(VDD) MIC_R.5(VDD) U?#6.10(IOVdd) U?#6.30(Vsys)  [project net lipo_SW]
GND: C?#4.1 C?#5.1 C?#6.1 C?#7.1 C?#8.1 C?#9.1 C?#10.1 C?#12.1 C?#13.1 C?#15.1 C?#17.1 MIC_L.2(GND) MIC_L.3(GND) MIC_L.4(GND) MIC_R.2(GND) MIC_R.3(GND) MIC_R.4(GND) U?#6.1(DVss) U?#6.2(DVss) U?#6.11(IOVss) U?#6.16(SPI_SELECT) U?#6.21(AVss) U?#6.28(GND_SENSE) U?#6.37(DVss_CP) U?#6.PAD
MIC_L: C?#14.2
MIC_R: C?#16.2
NetC?#11_1: C?#11.1 U?#6.38(FLY_P)
NetC?#11_2: C?#11.2 U?#6.36(FLY_N)
NetC?#12_2: C?#12.2 U?#6.22(REF)
NetC?#13_2: C?#13.2 U?#6.35(VNEG)
NetC?#14_1: C?#14.1 MIC_L.1(OUT+)
NetC?#16_1: C?#16.1 MIC_R.1(OUT+)

Not connected (* = marked no-connect by the designer): MIC_L 6(OUT-)*; MIC_R 6(OUT-)*; U?#6 3(~{RESET}) 4(GPIO/MFP5)* 5(MCLK) 6(BCLK) 7(WCLK) 8(DIN/MFP1) 9(DOUT/MFP2) 12(SCLK/MFP3) 13(SCL/~{SS}) 14(SDA/MOSI) 15(MISO/MFP4) 17(IN1_L) 18(IN1_R) 19(IN2_L) 20(IN2_R) 23(MICBIAS) 24(IN3_L) 25(IN3_R) 26(LOL) 27(LOR) 31(HPL) 33(HPR) 34(MICDET)

### Library data of the parts
C?#4 C?#5 C?#7 C?#8 C?#15 C?#17 = GRM155R71E104KE14D: 100 nF, 25 V, X7R, 0402 Chip capacitor; Manufacturer: Murata; Dielectric Material: Ceramic; Tolerance: 10%; Supplier 1: Digi-Key; Supplier Part Number 1: 490-10698-1-ND; RoHS: Yes; Category: Ceramic Capacitors; Pricing 1: 1=0.10000, 10=0.02700, 50=0.01460, 100=0.01190, 500=0.00848, 1000=0.00666, 2500=0.00605, 5000=0.00557 (USD); Mount: Surface Mount; Case/Package: 0402; Case Code (Metric): 1005; Weight: 0.000212oz; Min Operating Temperature: -55°C; Max Operating Temperature: 125°C; Packaging: Tape and Reel; Voltage Rating: 25V; Dielectric: X7R; Termination: SMD/SMT; Resistor Type: Ceramic; Voltage Rating (DC): 25V; Package Quantity: 10000; Length: 1mm; Width: 0.02inch; Height: 0.5mm; Thickness: 0.022inch; Depth: 0.5mm; REACH SVHC: Unknown; Lead Free: Lead Free; RoHS Compliant: Yes; ComponentLink1URL: http://www.farnell.com/datasheets/1872206.pdf?src-supplier=Farnell; ComponentLink1Description: http://www.farnell.com/datasheets/1872206.pdf?src-supplier=Farnell; ComponentLink2URL: http://components.arrow.com/part/dataview/0323_06361249?src-supplier=Arrow+Europe; ComponentLink2Description: http://components.arrow.com/part/dataview/0323_06361249?src-supplier=Arrow+Europe; ComponentLink3URL: http://uk.rs-online.com/webdocs/144c/0900766b8144c113.pdf?src-supplier=RSComponents; ComponentLink3Description: http://uk.rs-online.com/webdocs/144c/0900766b8144c113.pdf?src-supplier=RSComponents; ComponentLink4URL: http://www.farnell.com/datasheets/2048008.pdf?src-supplier=Farnell; ComponentLink4Description: http://www.farnell.com/datasheets/2048008.pdf?src-supplier=Farnell; ComponentLink5URL: http://www.mouser.com/ds/2/281/c02e-2905.pdf?src-supplier=Mouser; ComponentLink5Description: http://www.mouser.com/ds/2/281/c02e-2905.pdf?src-supplier=Mouser; ComponentLink6URL: http://www.farnell.com/datasheets/2048008.pdf?src-supplier=Newark; ComponentLink6Description: http://www.farnell.com/datasheets/2048008.pdf?src-supplier=Newark; ComponentLink7URL: https://search.murata.co.jp/Ceramy/image/img/A01X/G101/ENG/GRM155R71E104KE14-01.pdf?src-supplier=Digi-Key; ComponentLink7Description: https://search.murata.co.jp/Ceramy/image/img/A01X/G101/ENG/GRM155R71E104KE14-01.pdf?src-supplier=Digi-Key; ComponentLink8URL: http://www.farnell.com/datasheets/2048008.pdf?src-supplier=Element14; ComponentLink8Description: http://www.farnell.com/datasheets/2048008.pdf?src-supplier=Element14; ComponentLink9URL: http://psearch.en.murata.com/capacitor/product/GRM155R71E104KE14%23.pdf?src-supplier=Avnet; ComponentLink9Description: http://psearch.en.murata.com/capacitor/product/GRM155R71E104KE14%23.pdf?src-supplier=Avnet; Manufacturer Part Number: GRM155R71E104KE14D
C?#6 C?#10 C?#12 = CL05A106MP8NUB8: as C?#1 on sheet power; Supplier 1: Digi-Key; Supplier Part Number 1: 1276-6830-1-ND; RoHS: Yes; Category: Ceramic Capacitors; Stock 1: 740658; Pricing 1: 1=0.36000, 10=0.25300, 50=0.17720, 100=0.15180, 500=0.11384, 1000=0.09614, 2500=0.09108 (USD); Mount: Surface Mount; Case/Package: 0402; Case Code (Metric): 1005; Min Operating Temperature: -55°C; Max Operating Temperature: 85°C; Packaging: Tape and Reel; Length: 0.039inch; Width: 0.02inch; Thickness: 0.035inch; RoHS Compliant: Yes; ComponentLink1URL: http://www.samsungsem.com/kr/support/product-search/mlcc/CL05A106MP8NUB8.jsp?src-supplier=Digi-Key; ComponentLink1Description: http://www.samsungsem.com/kr/support/product-search/mlcc/CL05A106MP8NUB8.jsp?src-supplier=Digi-Key; Manufacturer Part Number: CL05A106MP8NUB8
C?#9 = GRM155R61E105KA12D: 1 µF, 25 V, X5R, 0402 Chip capacitor; Manufacturer: Murata; Dielectric Material: Ceramic; Multilayer: Yes; Negative Tolerance: 10%; Supplier 1: Digi-Key; Supplier Part Number 1: 490-10017-1-ND; RoHS: Yes; Category: Ceramic Capacitors; Stock 1: 145965; Pricing 1: 1=0.11000, 10=0.08300, 50=0.04560, 100=0.03720, 500=0.02656, 1000=0.02087, 2500=0.01898, 5000=0.01746 (USD); Mount: Surface Mount; Number of Pins: 2; Package Shape: Rectangular; Terminal Finish: Nickel; Min Operating Temperature: -55°C; Max Operating Temperature: 85°C; JESD-609 Code: e3; Capacitor Type: Ceramic; Package Style: SMTMeter; Packaging: Tape and Reel; Positive Tolerance: 10%; Temperature Characteristics Code: X5R; Termination: Wraparound; Length: 1mm; Width: 0.5mm; Height: 0.5mm; REACH SVHC: Yes; RoHS Compliant: Yes; ComponentLink1URL: https://datasheet.ciiva.com:443/pdfs/VipMasterIC/IC/MURE/MURE-S-A0004362469/MURE-S-A0004364524-1.pdf?src-supplier=IHS+Markit; ComponentLink1Description: https://datasheet.ciiva.com:443/pdfs/VipMasterIC/IC/MURE/MURE-S-A0004362469/MURE-S-A0004364524-1.pdf?src-supplier=IHS+Markit; ComponentLink2URL: https://datasheet.ciiva.com/7719/1666664-7719006.pdf?src-supplier=Element14; ComponentLink2Description: https://datasheet.ciiva.com/7719/1666664-7719006.pdf?src-supplier=Element14; ComponentLink3URL: https://datasheet.ciiva.com/22732/1666664-22732122.pdf?src-supplier=Element14; ComponentLink3Description: https://datasheet.ciiva.com/22732/1666664-22732122.pdf?src-supplier=Element14; Manufacturer Part Number: GRM155R61E105KA12D
C?#11 C?#13 C?#14 C?#16 = TMK105CBJ225MV-F: as C?#2 on sheet digital; Supplier 1: Digi-Key; Supplier Part Number 1: 587-6022-1-ND; RoHS: Yes; Category: Ceramic Capacitors; Stock 1: 6102; Pricing 1: 1=0.22000, 10=0.15600, 50=0.08880, 100=0.07350, 500=0.05156, 1000=0.04269, 2500=0.03973, 5000=0.03635 (USD); Mount: Surface Mount; Number of Pins: 2; Package Shape: Rectangular; Min Operating Temperature: -55°C; Max Operating Temperature: 85°C; Capacitor Type: Ceramic; Package Style: SMTMeter; Packaging: Tape and Reel; Positive Tolerance: 20%; Temperature Characteristics Code: X5R; Termination: Wraparound; Length: 1mm; Width: 0.5mm; Height: 0.5mm; REACH SVHC: Yes; RoHS Compliant: Yes; ComponentLink1URL: https://datasheet.ciiva.com:443/pdfs/VipMasterIC/IC/TAIY/TAIY-S-A0009103435/TAIY-S-A0009102688-1.pdf?src-supplier=IHS+Markit; ComponentLink1Description: https://datasheet.ciiva.com:443/pdfs/VipMasterIC/IC/TAIY/TAIY-S-A0009103435/TAIY-S-A0009102688-1.pdf?src-supplier=IHS+Markit; ComponentLink2URL: https://ds.yuden.co.jp/TYCOMPAS/ut/detail?pn=TMK105CBJ225MV-F &amp;u=M&src-supplier=Digi-Key; ComponentLink2Description: https://ds.yuden.co.jp/TYCOMPAS/ut/detail?pn=TMK105CBJ225MV-F &amp;u=M&src-supplier=Digi-Key; ComponentLink3URL: http://ds.yuden.co.jp/TYCOMPAS/ut/detail.do?productNo=TMK105CBJ225MV-F&amp;fileName=TMK105CBJ225MV-F_SS&amp;mode=specSheetDownload&src-supplier=Digi-Key; ComponentLink3Description: http://ds.yuden.co.jp/TYCOMPAS/ut/detail.do?productNo=TMK105CBJ225MV-F&amp;fileName=TMK105CBJ225MV-F_SS&amp;mode=specSheetDownload&src-supplier=Digi-Key; Manufacturer Part Number: TMK105CBJ225MV-F
MIC_L MIC_R = SPM0687LR5H-1: Analog MEMS microphone; Manufacturer: Knowles; Shape: Rectangular; Operating Supply Current: 285uA; Supplier 1: Digi-Key; Stock 1: 8303; Pricing 1: 1=1.91, 10=1.589, 25=1.4692, 50=1.3814, 100=1.297, 500=1.1134, 1000=1.0628 (USD); Output Type: Analog; Packaging: Cut Tape; Termination: Solder; ComponentLink1URL: https://media.digikey.com/pdf/Data%20Sheets/Knowles%20Acoustics%20PDFs/SPM0687LR5H-1.pdf?src-supplier=Digi-Key; ComponentLink1Description: https://media.digikey.com/pdf/Data%20Sheets/Knowles%20Acoustics%20PDFs/SPM0687LR5H-1.pdf?src-supplier=Digi-Key; ComponentLink2URL: https://media.digikey.com/pdf/Data%20Sheets/Knowles%20Acoustics%20PDFs/SPM0687LR5H-1_DS.pdf?src-supplier=Digi-Key; ComponentLink2Description: https://media.digikey.com/pdf/Data%20Sheets/Knowles%20Acoustics%20PDFs/SPM0687LR5H-1_DS.pdf?src-supplier=Digi-Key; Supplier Part Number 1: 423-1427-1-ND; Manufacturer Part Number: SPM0687LR5H-1
U?#6 = TLV320AIC3206IRSBR: Stereo audio CODEC, WQFN-40; Manufacturer: Texas Instruments; Interface: I2C,SPI,Serial,I2S,2-Wire; Operating Supply Voltage: 1.8V; Max Supply Voltage: 1.95V; Resolution: 32b; Number of A/D Converters: 2; Sampling Rate: 192KS/s; Signal to Noise Ratio (SNR): 93dB; Power Consumption: 5mW; Number of Analog Inputs: 6; Number of Analog Outputs: 4; Supplier 1: Digi-Key; Stock 1: 2633; Pricing 1: 1=6.12, 10=5.495, 25=5.1944, 100=4.5019, 250=4.271, 500=3.8324, 1000=3.6373 (USD); Mount: Surface Mount; Number of Pins: 40; Min Operating Temperature: -40°C; Max Operating Temperature: 85°C; Package Quantity: 3000; Packaging: Tape and Reel; Number of D/A Converters: 2; Number of ADC Channels: 2; Number of DAC Channels: 2; Type: General Purpose; Series: PowerTune™; Radiation Hardening: No; Lead Free: Lead Free; RoHS Compliant: Yes; ComponentLink1URL: http://www.ti.com/lit/ds/symlink/tlv320aic3206.pdf?src-supplier=Digi-Key; ComponentLink1Description: http://www.ti.com/lit/ds/symlink/tlv320aic3206.pdf?src-supplier=Digi-Key; Supplier Part Number 1: 296-41705-1-ND; Manufacturer Part Number: TLV320AIC3206IRSBR

## Nets that join several sheets
GND: power (33 pins), digital (18 pins), audio (25 pins)
lipo_SW: power (11 pins), digital (9 pins), audio (9 pins)